# EAGLE schematic main_board2 (EAGLE 7.6.0)
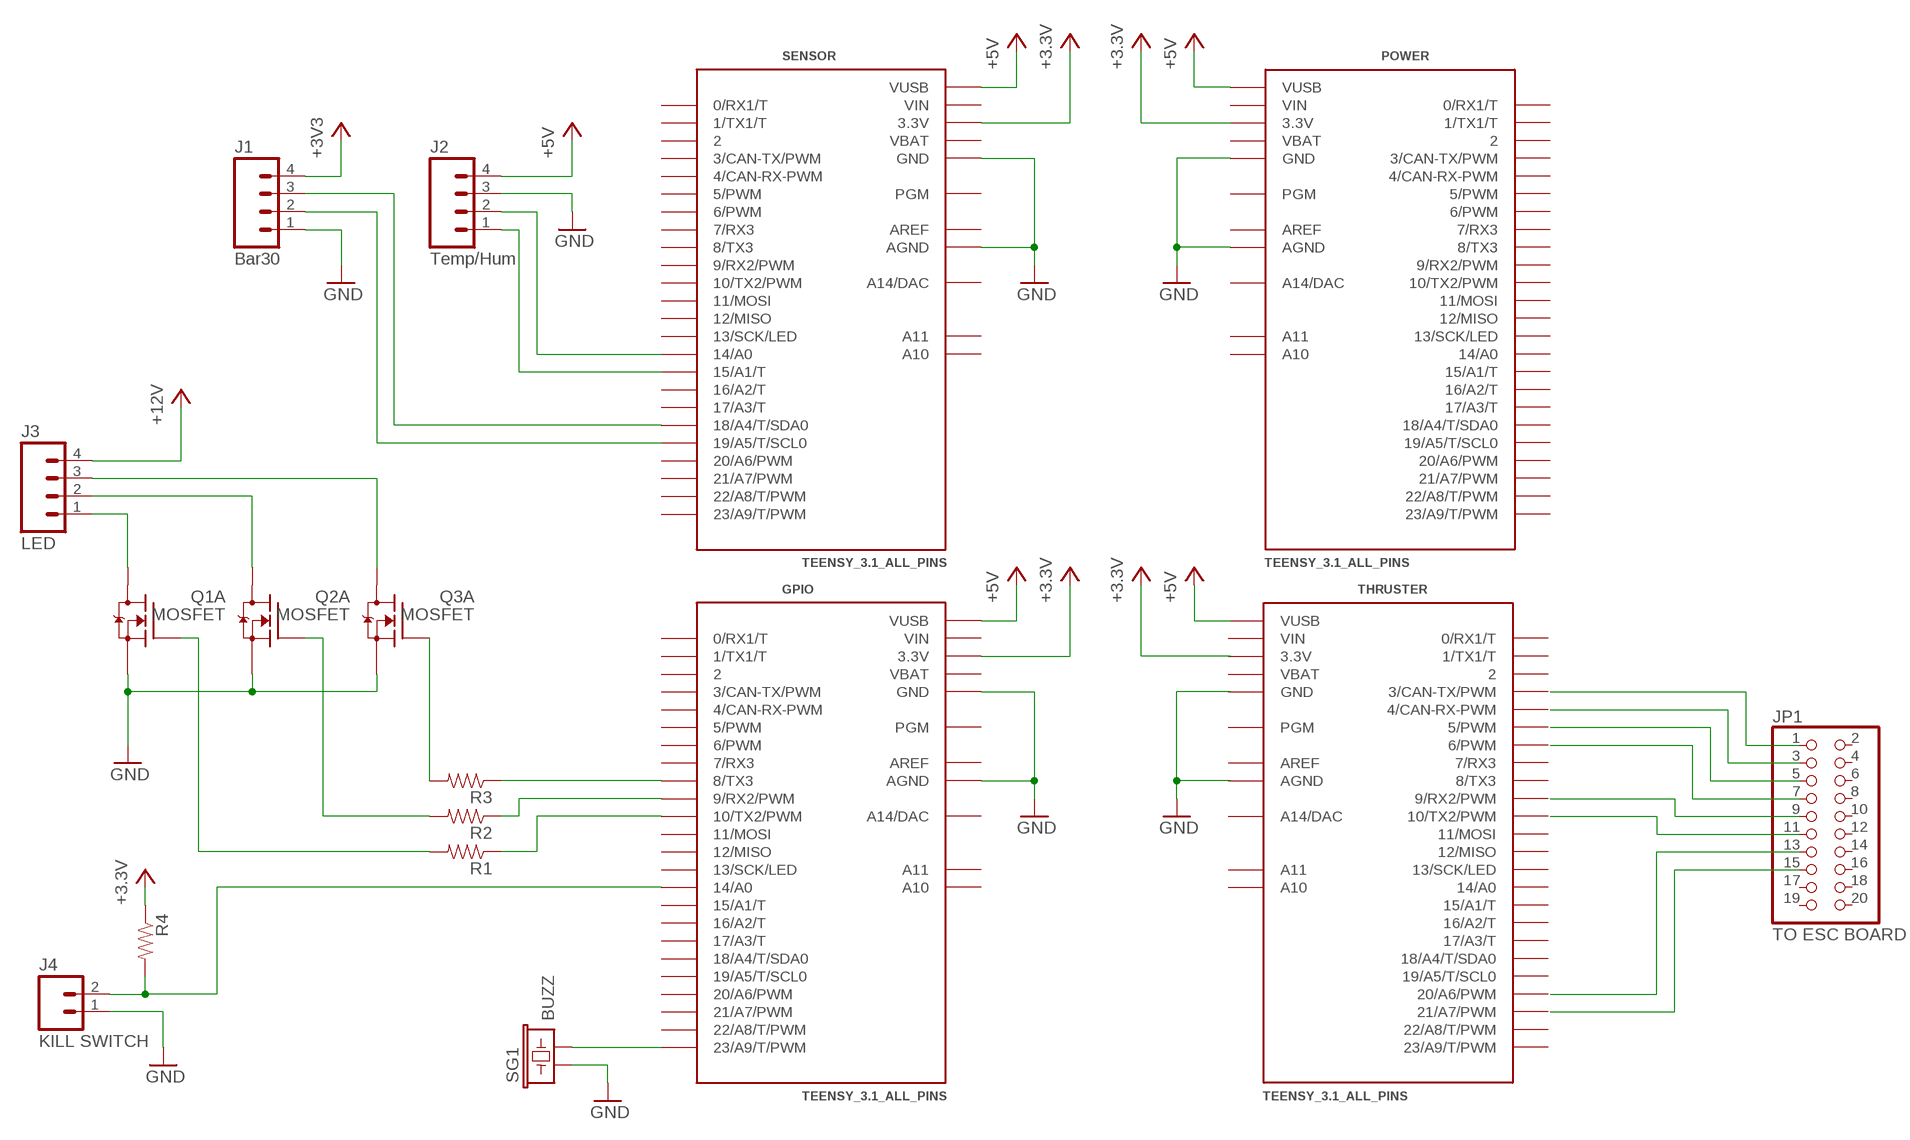
[diagram p0: schematic, sheet 1]

## Parts
GPIO  TEENSY_3.1_ALL_PINS  [TEENSY3-ALL_PINS]
J1  Bar30  M04PTH  [1X04]
J2  Temp/Hum  M04PTH  [1X04]
J3  LED  M04PTH  [1X04]
J4  KILL SWITCH  M02PTH  [1X02]
JP1  TO ESC BOARD  PINHD-2X10  [2X10]
POWER  TEENSY_3.1_ALL_PINS  [TEENSY3-ALL_PINS]
Q1  MOSFET  MOSFET-NCHANNEL_DUALFDMA1024NZ  [MICROFET_2X2]
Q2  MOSFET  MOSFET-NCHANNEL_DUALFDMA1024NZ  [MICROFET_2X2]
Q3  MOSFET  MOSFET-NCHANNEL_DUALFDMA1024NZ  [MICROFET_2X2]
R1  RESISTORPTH-1/4W  [AXIAL-0.4]
R2  RESISTORPTH-1/4W  [AXIAL-0.4]
R3  RESISTORPTH-1/4W  [AXIAL-0.4]
R4  RESISTORPTH-1/4W  [AXIAL-0.4]
SENSOR  TEENSY_3.1_ALL_PINS  [TEENSY3-ALL_PINS]
SG1  BUZZ  BUZZERPTH  [BUZZER-12MM]
THRUSTER  TEENSY_3.1_ALL_PINS  [TEENSY3-ALL_PINS]

## Nets
+3V3: J1.4
+5V: GPIO.3.3V GPIO.3.3V1(3.3V) GPIO.VUSB J2.4 POWER.3.3V POWER.3.3V1(3.3V) POWER.VUSB R4.P$1 SENSOR.3.3V SENSOR.3.3V1(3.3V) SENSOR.VUSB ; supply symbol labelled +3.3V
+12V: J3.4
GND: GPIO.AGND GPIO.GND GPIO.GND1(GND) J1.1 J2.3 J4.1 POWER.AGND POWER.GND POWER.GND1(GND) Q1.S1(A:S) Q2.S1(A:S) Q3.S1(A:S) SENSOR.AGND SENSOR.GND SENSOR.GND1(GND) SG1.+
N$1: J1.2 SENSOR.19/A5(19/A5/T/SCL0)
N$2: JP1.1
N$3: JP1.3
N$4: JP1.5
N$5: JP1.7
N$6: JP1.9
N$7: JP1.11
N$8: JP1.13
N$9: JP1.15
N$10: J1.3 SENSOR.18/A4(18/A4/T/SDA0)
N$11: J2.1 SENSOR.15/A1(15/A1/T)
N$12: GPIO.8(8/TX3) R3.P$1
N$13: GPIO.23/A9(23/A9/T/PWM) SG1.-
N$14: GPIO.9(9/RX2/PWM) R2.P$1
N$15: GPIO.10(10/TX2/PWM) R1.P$1
N$16: Q3.G1(A:G) R3.P$2
N$17: Q2.G1(A:G) R2.P$2
N$18: Q1.G1(A:G) R1.P$2
N$19: J3.3 Q3.D1_2(A:D1)
N$20: GPIO.14/A0 J4.2 R4.P$2
N$21: J2.2 SENSOR.14/A0
N$23: J3.1 Q1.D1_2(A:D1)
N$24: J3.2 Q2.D1_2(A:D1)
Unconnected: GPIO.0(0/RX1/T) GPIO.1(1/TX1/T) GPIO.2 GPIO.3(3/CAN-TX/PWM) GPIO.4(4/CAN-RX-PWM) GPIO.5(5/PWM) GPIO.6(6/PWM) GPIO.7(7/RX3) GPIO.11(11/MOSI) GPIO.12(12/MISO) GPIO.13(13/SCK/LED) GPIO.15/A1(15/A1/T) GPIO.16/A2(16/A2/T) GPIO.17/A3(17/A3/T) GPIO.18/A4(18/A4/T/SDA0) GPIO.19/A5(19/A5/T/SCL0) GPIO.20/A6(20/A6/PWM) GPIO.21/A7(21/A7/PWM) GPIO.22/A8(22/A8/T/PWM) GPIO.A10 GPIO.A11 GPIO.PGM GPIO.RESET/DAC(A14/DAC) JP1.2 JP1.4 JP1.6 JP1.8 JP1.10 JP1.12 JP1.14 JP1.16 JP1.17 JP1.18 JP1.19 JP1.20 POWER.0(0/RX1/T) POWER.1(1/TX1/T) POWER.2 POWER.3(3/CAN-TX/PWM) POWER.4(4/CAN-RX-PWM) POWER.5(5/PWM) POWER.6(6/PWM) POWER.7(7/RX3) POWER.8(8/TX3) POWER.9(9/RX2/PWM) POWER.10(10/TX2/PWM) POWER.11(11/MOSI) POWER.12(12/MISO) POWER.13(13/SCK/LED) POWER.14/A0 POWER.15/A1(15/A1/T) POWER.16/A2(16/A2/T) POWER.17/A3(17/A3/T) POWER.18/A4(18/A4/T/SDA0) POWER.19/A5(19/A5/T/SCL0) POWER.20/A6(20/A6/PWM) POWER.21/A7(21/A7/PWM) POWER.22/A8(22/A8/T/PWM) POWER.23/A9(23/A9/T/PWM) POWER.A10 POWER.A11 POWER.PGM POWER.RESET/DAC(A14/DAC) Q1.D1(A:D) Q1.D2(B:D) Q1.D2_2(B:D1) Q1.G2(B:G) Q1.S2(B:S) Q2.D1(A:D) Q2.D2(B:D) Q2.D2_2(B:D1) Q2.G2(B:G) Q2.S2(B:S) Q3.D1(A:D) Q3.D2(B:D) Q3.D2_2(B:D1) Q3.G2(B:G) Q3.S2(B:S) SENSOR.0(0/RX1/T) SENSOR.1(1/TX1/T) SENSOR.2 SENSOR.3(3/CAN-TX/PWM) SENSOR.4(4/CAN-RX-PWM) SENSOR.5(5/PWM) SENSOR.6(6/PWM) SENSOR.7(7/RX3) SENSOR.8(8/TX3) SENSOR.9(9/RX2/PWM) SENSOR.10(10/TX2/PWM) SENSOR.11(11/MOSI) SENSOR.12(12/MISO) SENSOR.13(13/SCK/LED) SENSOR.16/A2(16/A2/T) SENSOR.17/A3(17/A3/T) SENSOR.20/A6(20/A6/PWM) SENSOR.21/A7(21/A7/PWM) SENSOR.22/A8(22/A8/T/PWM) SENSOR.23/A9(23/A9/T/PWM) SENSOR.A10 SENSOR.A11 SENSOR.PGM SENSOR.RESET/DAC(A14/DAC) THRUSTER.0(0/RX1/T) THRUSTER.1(1/TX1/T) THRUSTER.2 THRUSTER.3(3/CAN-TX/PWM) THRUSTER.4(4/CAN-RX-PWM) THRUSTER.5(5/PWM) THRUSTER.6(6/PWM) THRUSTER.7(7/RX3) THRUSTER.8(8/TX3) THRUSTER.9(9/RX2/PWM) THRUSTER.10(10/TX2/PWM) THRUSTER.11(11/MOSI) THRUSTER.12(12/MISO) THRUSTER.13(13/SCK/LED) THRUSTER.14/A0 THRUSTER.15/A1(15/A1/T) THRUSTER.16/A2(16/A2/T) THRUSTER.17/A3(17/A3/T) THRUSTER.18/A4(18/A4/T/SDA0) THRUSTER.19/A5(19/A5/T/SCL0) THRUSTER.20/A6(20/A6/PWM) THRUSTER.21/A7(21/A7/PWM) THRUSTER.22/A8(22/A8/T/PWM) THRUSTER.23/A9(23/A9/T/PWM) THRUSTER.A10 THRUSTER.A11 THRUSTER.PGM THRUSTER.RESET/DAC(A14/DAC)

## Power pins joined to a net without a drawn wire
3.3V: THRUSTER.3.3V THRUSTER.3.3V1(3.3V)
AGND: THRUSTER.AGND
AREF: GPIO.AREF POWER.AREF SENSOR.AREF THRUSTER.AREF
GND: THRUSTER.GND THRUSTER.GND1(GND)
VBAT: GPIO.VBAT POWER.VBAT SENSOR.VBAT THRUSTER.VBAT
VIN: GPIO.VIN POWER.VIN SENSOR.VIN THRUSTER.VIN
VUSB: THRUSTER.VUSB

## Library data of the parts
GPIO POWER SENSOR THRUSTER = Teensy_3_and_LC_Series_Boards_v1.1:TEENSY_3.1_ALL_PINS: Footprint for Teensy 3.1 or 3.2 board using all through-holes, i.e. the entire perimeter plus the 4 through-holes inboard (A10,A11,AREF, VUSB)
J1-J3 = SparkFun-Connectors:M04: Header 4 Standard 4-pin 0.1" header. Use with straight break away headers (SKU : PRT-00116), right angle break away headers (PRT-00553), swiss pins (PRT-00743), machine pins (PRT-00117), and female headers (PRT-00115). Molex polarized connector foot print use with SKU : PRT-08231 with associated crimp pins and housings. 1MM SMD Version SKU: PRT-10208; PROD_ID: CONN-09696
J4 = SparkFun-Connectors:M02: Standard 2-pin 0.1" header. Use with - straight break away headers ( PRT-00116) - right angle break away headers (PRT-00553) - swiss pins (PRT-00743) - machine pins (PRT-00117) - female headers (PRT-00115) Molex polarized connector foot print use with: PRT-08233 with associated crimp pins and housings. 2.54_SCREWTERM for use with PRT-10571. 3.5mm Screw Terminal footprints for PRT-08084 5mm Screw Terminal footprints for use with PRT-08432
JP1 = pinhead:PINHD-2X10: PIN HEADER
Q1-Q3 = SparkFun-DiscreteSemi:MOSFET-NCHANNEL_DUAL: Dual N-Channel 30-V (D-S) MOSFET FDMA1024NZ TRANS-09516 http://www.vishay.com/docs/71053/71053.pdf; PROD_ID: TRANS-09516
R1-R4 = SparkFun-Resistors:RESISTOR: Resistor Basic schematic elements and footprints for 0603, 1206, and PTH resistors.
SG1 = SparkFun-Electromechanical:BUZZER: Buzzer 12mm Spark Fun Electronics SKU : Comp-Buzzer